# EAGLE design C128_AV-Adapter (EAGLE 9.6.2)
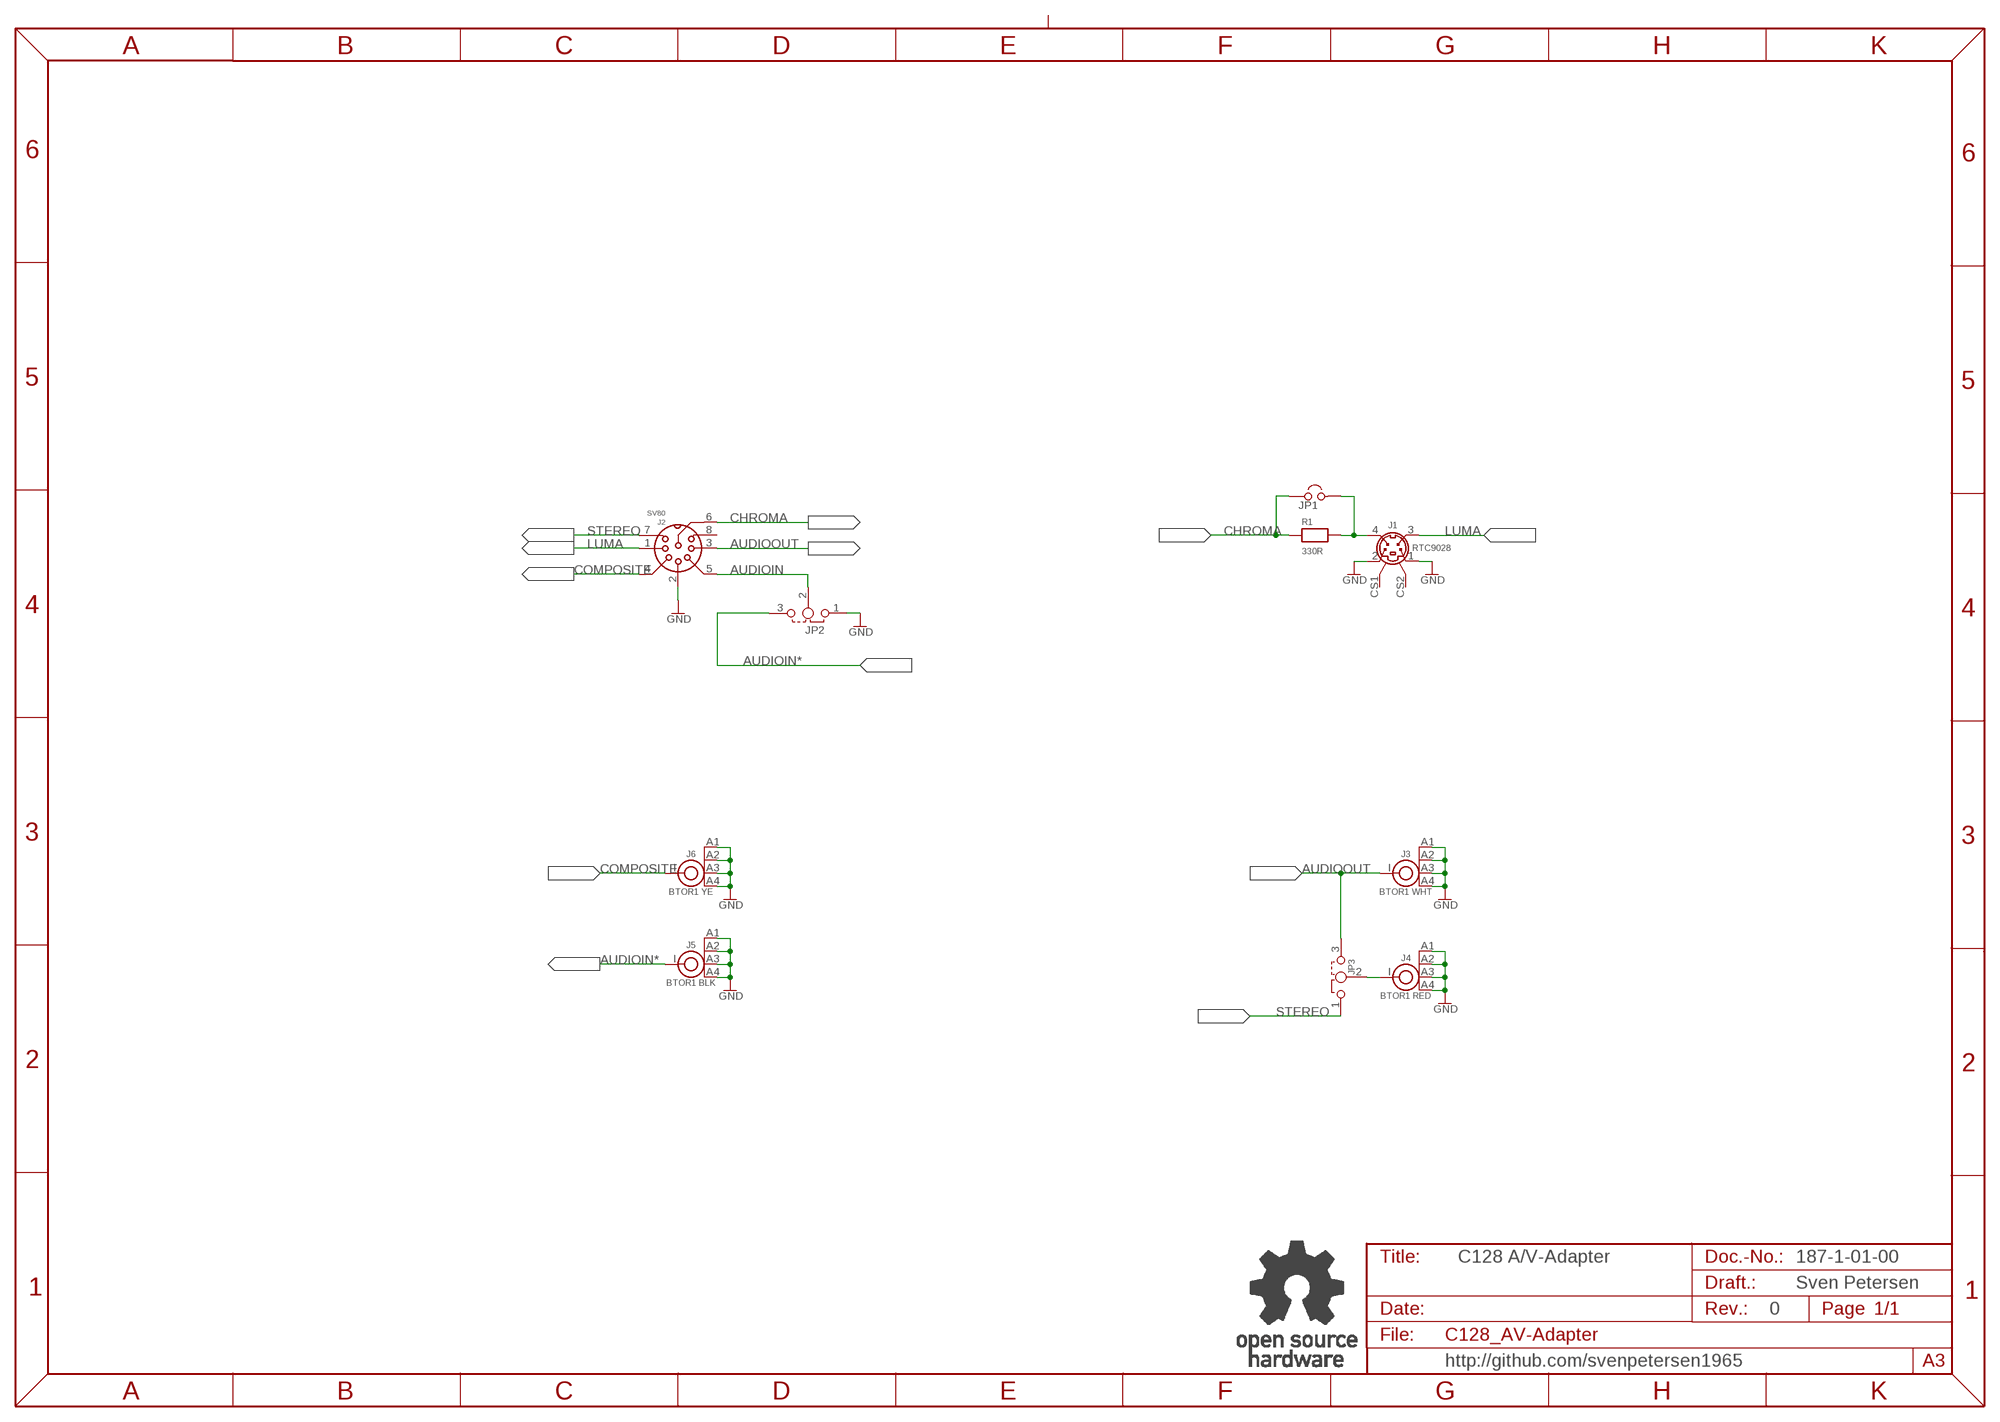
[diagram p0: schematic, sheet 1]

## Parts
J1  RTC9028  [MINIDIN4_V]
J2  SV80  [SV80_INNER]
J3  BTOR1 WHT  BTOR1  [BTOR1]
J4  BTOR1 RED  BTOR1  [BTOR1]
J5  BTOR1 BLK  BTOR1  [BTOR1]
J6  BTOR1 YE  BTOR1  [BTOR1]
JP1  JUMPER  [1X02]
JP2  DJUMPER  [1X03]
JP3  DJUMPER  [1X03]
R1  330R  RES04  [R-10]
U$25  OPEN_SOURCE_HW  [OPENHW]

## Nets
AUDIOIN: J2.5 JP2.2
AUDIOIN*: J5.I JP2.3
AUDIOOUT: J2.3 J3.I JP3.3
AUDIOR: J4.I JP3.2
CHROMA: J2.6 JP1.1 R1.1
COMPOSITE: J2.4 J6.I
GND: J1.1 J1.2 J2.2 J3.A1 J3.A2 J3.A3 J3.A4 J4.A1 J4.A2 J4.A3 J4.A4 J5.A1 J5.A2 J5.A3 J5.A4 J6.A1 J6.A2 J6.A3 J6.A4 JP2.1
LUMA: J1.3 J2.1
N$1: J1.4 JP1.2 R1.2
STEREO: J2.7 JP3.1
Unconnected: J1.CS1 J1.CS2 J2.8

## Notes on the sheet
- C128 A/V-Adapter | 187-1-01-00
- Sven Petersen
- 0
- http://github.com/svenpetersen1965

## Library data of the parts
J1 = RTConnector:RTC9028: Mini-DIN, 4p, vertical
J2 = Lumberg:SV80: Inner part of SV80
J3-J6 = Lumberg:BTOR1
JP1 = PINHEAD:JUMPER
JP2 JP3 = PINHEAD:DJUMPER
R1 = DISCRETE:RES04
U$25 = Logo:OPEN_SOURCE_HW

## Board
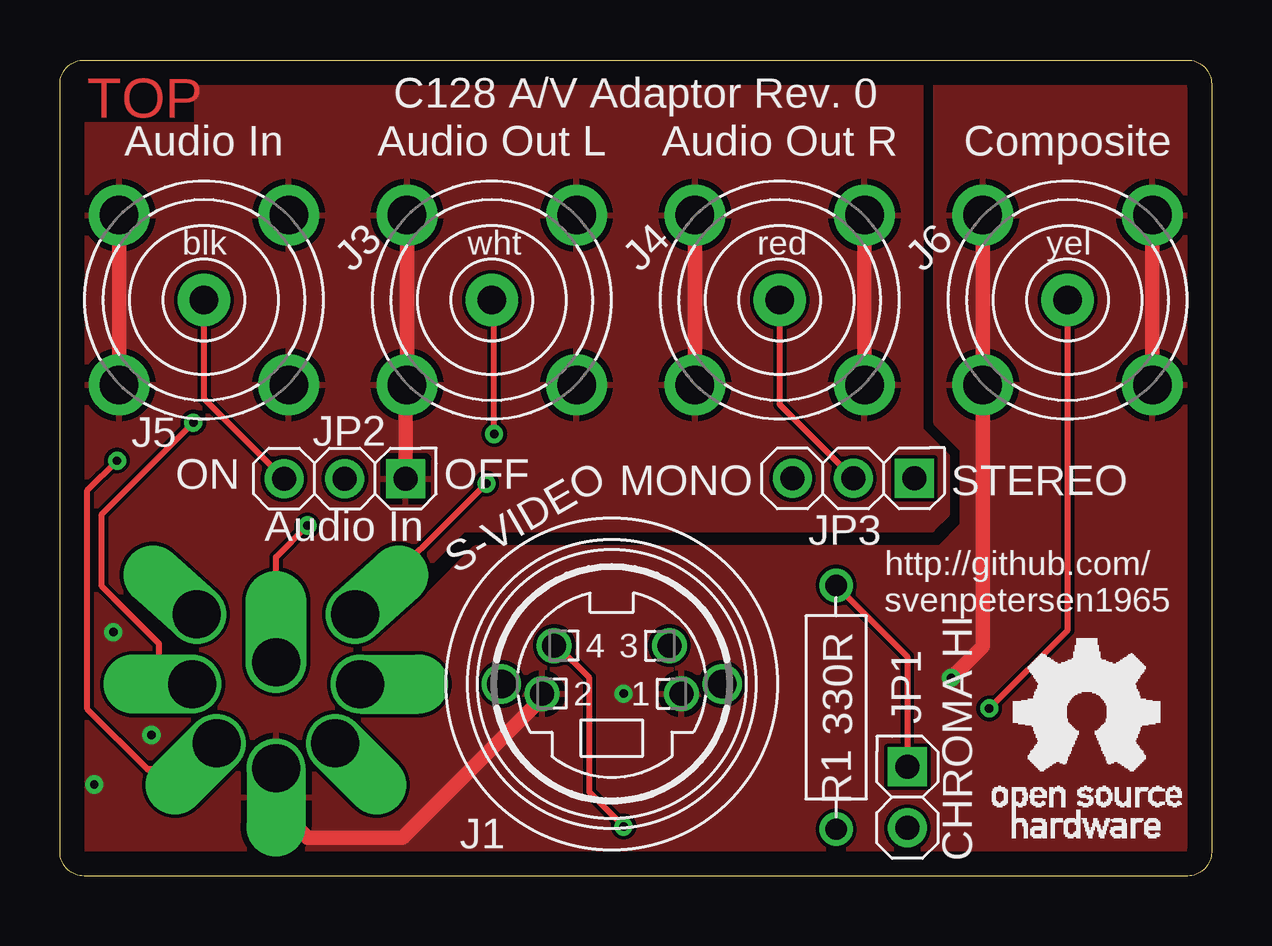
[diagram p1: board, top side]
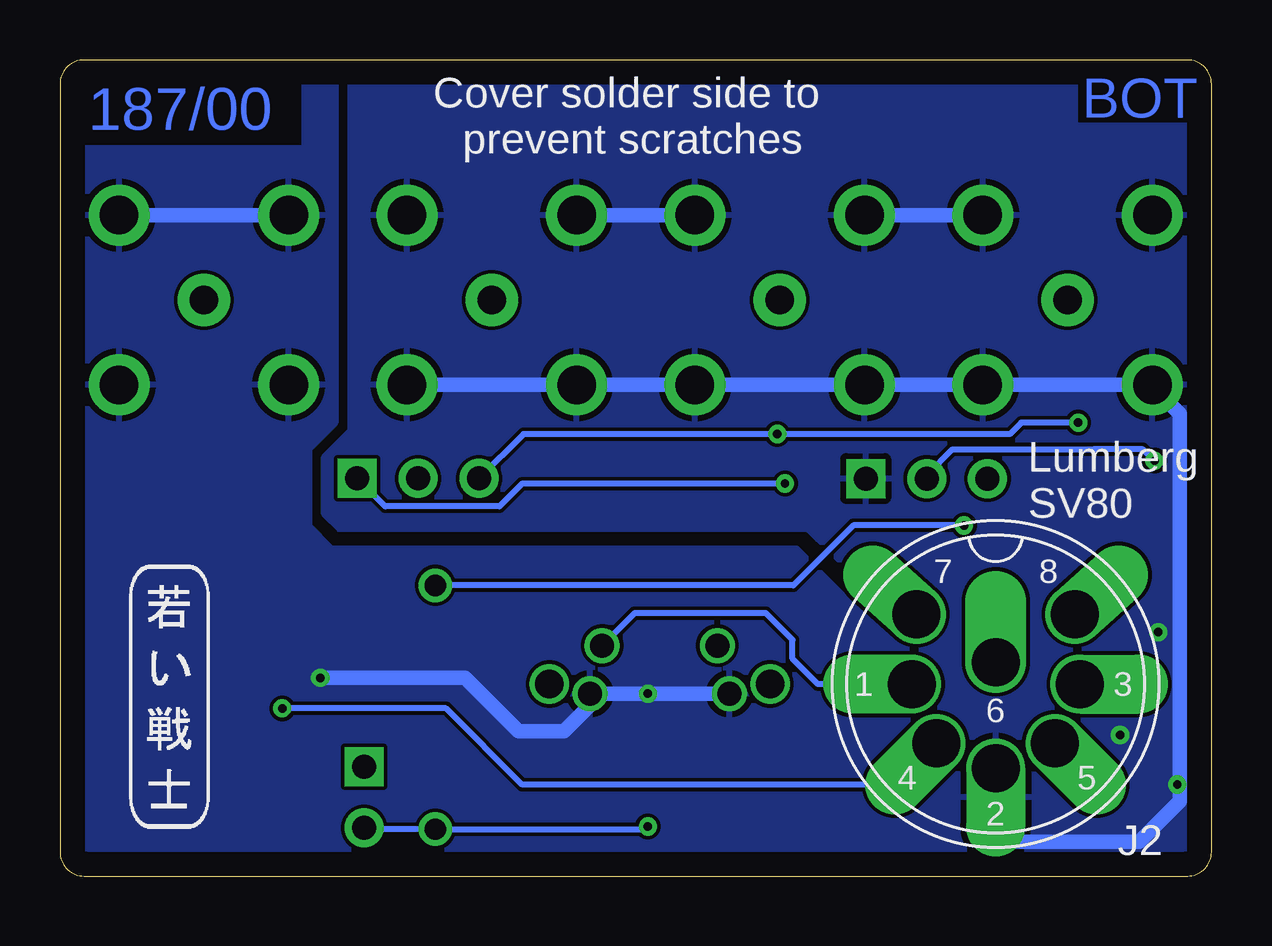
[diagram p2: board, bottom side, seen from below]

Size 48 x 34 mm. Coordinates in mm from the lower left corner, seen from the top.
Outline: 1,34 47,34 arc-90 48,33 48,1 arc-90 47,0 1,0 arc-90 0,1 0,33 arc-90 1,34
Copper layers (1*16): Top 0.035mm / dielectric 1.5mm / Bottom 0.035mm
Design rules "default *": minimum track width 6mil, minimum drill 0.35mm, track to track 6mil, track to pad 6mil, pad to pad 6mil, via to via 6mil, smd to smd 6mil, copper to edge 40mil, drill to drill 6mil, minimum pad ring 9mil, minimum via ring 8mil, stop-mask expansion 4mil, vias tented up to drill 25mil, thermal gap 10mil
bRestrict: 2 lines

### Footprints (pad centres in the part's own frame; a part is rotated, then mirrored left to right if it is on the bottom)
MINIDIN4_V = drill 1: 1 2.9,-0.4; 2 -2.9,-0.4; 3 2.4,1.6; 4 -2.4,1.6 | drill 1.2: CS1 4.6,0; CS2 -4.6,0
SV80_INNER = drill 2 pad 2.413 offset: 1 3.5,0; 2 0,3.5; 3 -3.5,0; 4 2.47,2.47; 5 -2.47,2.47; 7 3.3,-2.9; 8 -3.3,-2.9 | drill 2 pad 2.54 offset: 6 0,-0.9
BTOR1 = drill 1.6 pad 2.54: A1 0,5; A2 5,0; A3 0,-5; A4 -5,0 | drill 1.2 pad 2.184: I 0,0
1X02 = drill 1 pad 1.626 square: 1 -1.27,0 | drill 1 pad 1.626: 2 1.27,0
1X03 = drill 1 pad 1.626 square: 1 -2.54,0 | drill 1 pad 1.626: 2 0,0; 3 2.54,0
R-10 = drill 0.889 pad 1.397: 1 -5.08,0; 2 5.08,0

### Placement (x,y rotation side)
J1  23,8 0 top
J2  9,8 180 bottom
J3  18,24 45 top
J4  30,24 45 top
J5  6,24 45 top
J6  42,24 45 top
JP1  35.32,3.27 270 top
JP2  11.87,16.56 180 top
JP3  33.07,16.57 180 top
R1  32.35,7.03 270 top
U$22  [2LAYER]  1.11,31.59 0 top
U$23  [SVEN_TAG]  43.4,7.59 0 bottom
U$24  [PCB-TITLE/]  0,40.64 0 top  (outside the outline)
U$25  38.86,1.6 0 top

### Tracks (layer width: path | path; a pad name or v marks a point on that pad's centre or on a via)
AUDIOIN  (via drill 0.35)
  Top 0.254: J2.5 6.32,5.53 5.24,4.45 3.65,4.45 1.14,6.95 1.14,16.07 v2.38,17.3
  Bottom 0.254: v2.38,17.3 2.86,17.78 4.92,17.78 10.79,17.78 11.87,16.7 JP2.2
AUDIOIN*
  Top 0.254: JP2.3 6,19.89 J5.I
AUDIOOUT  (via drill 0.35)
  Top 0.254: J2.3 4.22,8 4.13,8.1 4.13,9.68 1.75,12.06 1.75,15.08 v5.56,18.89 | v18.1,18.41 18.1,23.9 J3.I
  Bottom 0.254: v5.56,18.89 7.94,18.89 8.41,18.41 v18.1,18.41 28.68,18.41 JP3.3
AUDIOR
  Top 0.254: JP3.2 30,19.64 J4.I
CHROMA  (via drill 0.35)
  Top 0.254: J2.6 9,13.29 v10.32,14.61 | R1.1 35.32,9.14 JP1.1
  Bottom 0.254: v10.32,14.61 14.94,14.61 17.43,12.11 R1.1
COMPOSITE  (via drill 0.35)
  Top 0.254: v38.73,6.99 42,10.25 J6.I
  Bottom 0.254: J2.4 13.19,3.81 28.73,3.81 31.91,6.99 v38.73,6.99
GND  (via drill 0.35)
  Top 0.254: J2.2 9.05,4.45 9.05,2.86
  Top 0.61: JP2.1 14.41,20.41 J3.A4 J3.A1 | J6.A1 J6.A4 38.46,9.57 v37.15,8.26 | J5.A4 J5.A1 | J4.A4 J4.A1 | J6.A3 J6.A2 | 9.05,2.86 10.32,1.59 14.29,1.59 20.1,7.4 J1.2 | J4.A3 J4.A2
  Bottom 0.61: J4.A3 J4.A4 J3.A3 J3.A4 J5.A3 J5.A4 2.46,20.4 1.32,19.26 1.32,3.12 3.02,1.43 8.41,1.43 9.05,2.06 9.05,4.45 J2.2 | J5.A2 J3.A1 | J3.A2 J4.A1 | J6.A1 J6.A2 | J1.2 v23.5,7.6 J1.1 25.9,7.12 26.99,6.03 28.89,6.03 31.11,8.26 v37.15,8.26
  other vias: 1.43,3.81 3.81,5.87 2.22,10.16
  pour Bottom: 0.95,33.02 0.95,0.79 47.15,0.79 47.15,13.48 47.15,33.02 36.51,33.02 36.51,18.89 37.62,17.78 37.62,14.61 36.67,13.65 17.3,13.65 15.4,11.75 14.05,11.75 16.83,14.45 36.35,14.45 36.99,15.08 36.99,17.46 35.88,18.57 35.88,33.02
  pour Top: 0.95,33.02 0.95,0.79 47.15,0.79 47.15,33.02 36.51,33.02 36.51,18.89 37.62,17.78 37.62,14.61 36.67,13.65 17.3,13.65 15.4,11.75 14.13,11.75 16.83,14.45 36.35,14.45 36.99,15.08 36.99,17.46 35.88,18.57 35.88,33.02
LUMA
  Bottom 0.254: J2.1 16.41,8 17.46,9.05 17.46,9.84 18.57,10.95 24.05,10.95 J1.3
N$1  (via drill 0.35)
  Top 0.254: v23.5,2.06 22.07,3.49 22.07,8.26 20.72,9.6 J1.4
  Bottom 0.254: v23.5,2.06 23.61,1.95 R1.2 35.26,1.95 JP1.2
STEREO  (via drill 0.35)
  Top 0.254: J2.7 17.75,16.35 v17.78,16.35
  Bottom 0.254: v17.78,16.35 28.73,16.35 29.69,15.4 34.44,15.4 JP3.1

### Text on the board
Bottom: 187/00
tPlace: C128 A/V Adaptor Rev. 0 | Audio In | Audio Out L | Audio Out R | Composite | blk | wht | red | yel | ON | OFF | MONO | STEREO | Audio In | S-VIDEO | http://github.com/ / svenpetersen1965 | 330R | CHROMA HI
bPlace: Cover solder side to / prevent scratches | Lumberg / SV80
Document: Sven Petersen | 187-2-01-00 | 2021 | 35µm | 2 | 0